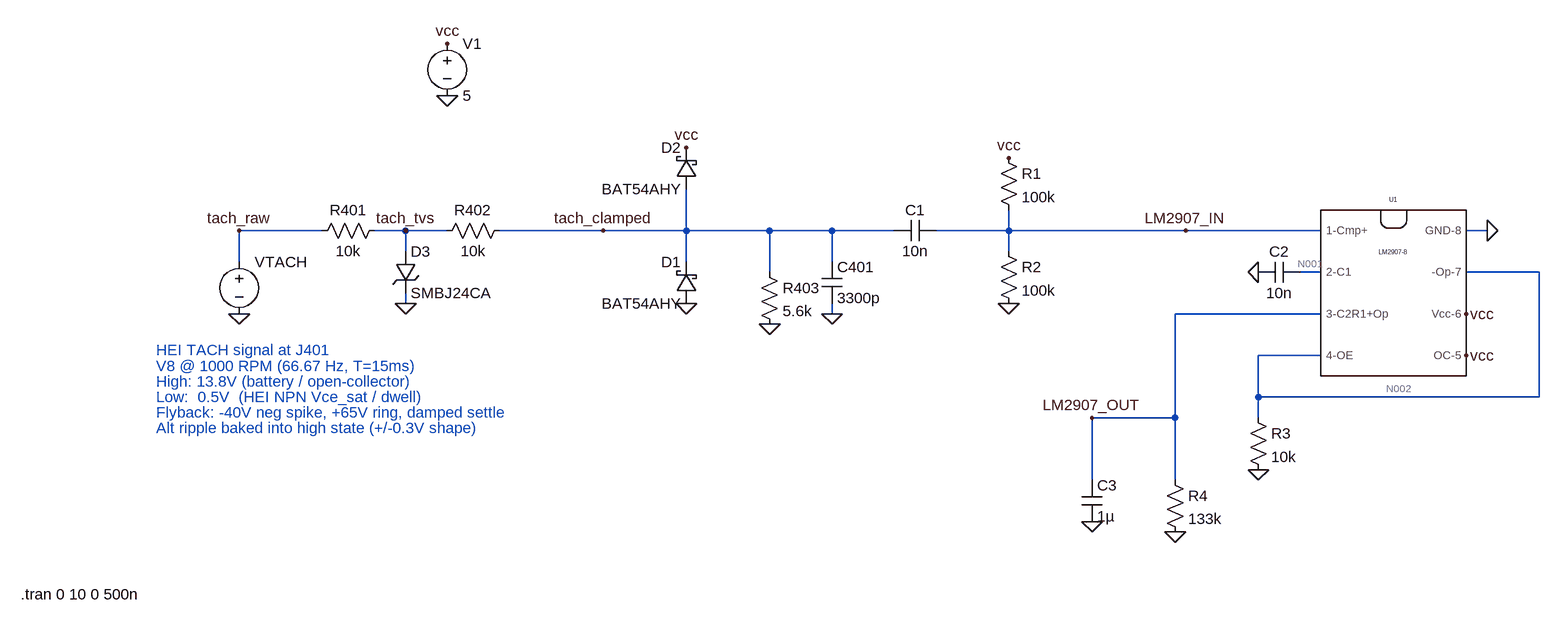
[diagram p0: schematic input_signal_draft.asc]
input_signal_draft.asc, the LTspice schematic file:
Version 4
SHEET 1 14944 1600
WIRE 512 800 384 800
WIRE 640 800 592 800
WIRE 704 800 640 800
WIRE 944 800 784 800
WIRE 1072 800 1072 736
WIRE 1072 800 944 800
WIRE 1200 800 1072 800
WIRE 1296 800 1200 800
WIRE 1392 800 1296 800
WIRE 1568 800 1568 768
WIRE 1568 800 1456 800
WIRE 1840 800 1568 800
WIRE 2048 800 1840 800
WIRE 2304 800 2272 800
WIRE 640 832 640 800
WIRE 1568 832 1568 800
WIRE 384 848 384 800
WIRE 1072 848 1072 800
WIRE 1296 848 1296 800
WIRE 1200 864 1200 800
WIRE 2048 864 2016 864
WIRE 2384 864 2272 864
WIRE 640 912 640 896
WIRE 1296 928 1296 912
WIRE 2048 928 1824 928
WIRE 2048 992 1952 992
WIRE 1952 1056 1952 992
WIRE 2384 1056 2384 864
WIRE 2384 1056 1952 1056
WIRE 1824 1088 1824 928
WIRE 1824 1088 1696 1088
WIRE 1952 1088 1952 1056
WIRE 1696 1184 1696 1088
WIRE 1824 1184 1824 1088
FLAG 384 928 0
FLAG 384 800 tach_raw
FLAG 944 800 tach_clamped
FLAG 1296 928 0
FLAG 1200 944 0
FLAG 1072 912 0
FLAG 704 592 0
FLAG 704 512 vcc
FLAG 1072 672 vcc
FLAG 1568 912 0
FLAG 1568 688 vcc
FLAG 1840 800 LM2907_IN
FLAG 640 912 0
FLAG 640 800 tach_tvs
FLAG 2304 800 0
FLAG 2272 928 vcc
FLAG 2272 992 vcc
FLAG 1952 1168 0
FLAG 1952 864 0
FLAG 1824 1264 0
FLAG 1696 1248 0
FLAG 1696 1088 LM2907_OUT
SYMBOL voltage 384 832 R0
WINDOW 3 -284 449 Invisible 2
WINDOW 123 0 0 Left 0
WINDOW 39 0 0 Left 0
SYMATTR InstName VTACH
SYMATTR Value PWL file=HEI_TACH_V8_1000to6000RPM_10s.txt
SYMBOL res 608 784 R90
WINDOW 0 0 56 VBottom 2
WINDOW 3 32 56 VTop 2
SYMATTR InstName R401
SYMATTR Value 10k
SYMBOL res 800 784 R90
WINDOW 0 0 56 VBottom 2
WINDOW 3 32 56 VTop 2
SYMATTR InstName R402
SYMATTR Value 10k
SYMBOL res 1184 848 R0
SYMATTR InstName R403
SYMATTR Value 5.6k
SYMBOL cap 1280 848 R0
SYMATTR InstName C401
SYMATTR Value 3300p
SYMBOL schottky 1088 736 R180
WINDOW 0 24 64 Left 2
WINDOW 3 24 0 Left 2
SYMATTR InstName D2
SYMATTR Value BAT54AHY
SYMATTR Description Diode
SYMATTR Type diode
SYMBOL schottky 1088 912 R180
WINDOW 0 24 64 Left 2
WINDOW 3 24 0 Left 2
SYMATTR InstName D1
SYMATTR Value BAT54AHY
SYMATTR Description Diode
SYMATTR Type diode
SYMBOL voltage 704 496 R0
SYMATTR InstName V1
SYMATTR Value 5
SYMBOL cap 1456 784 R90
WINDOW 0 0 32 VBottom 2
WINDOW 3 32 32 VTop 2
SYMATTR InstName C1
SYMATTR Value 10n
SYMBOL res 1552 672 R0
SYMATTR InstName R1
SYMATTR Value 100k
SYMBOL res 1552 816 R0
SYMATTR InstName R2
SYMATTR Value 100k
SYMBOL TVSdiode 624 832 R0
SYMATTR InstName D3
SYMATTR Value SMBJ24CA
SYMBOL LM2907-8 2160 896 R0
SYMATTR InstName U1
SYMBOL res 1936 1072 R0
SYMATTR InstName R3
SYMATTR Value 10k
SYMBOL cap 2016 848 R90
WINDOW 0 0 32 VBottom 2
WINDOW 3 32 32 VTop 2
SYMATTR InstName C2
SYMATTR Value 10n
SYMBOL res 1808 1168 R0
SYMATTR InstName R4
SYMATTR Value 133k
SYMBOL cap 1680 1184 R0
SYMATTR InstName C3
SYMATTR Value 1µ
TEXT 256 984 Left 2 ;HEI TACH signal at J401
TEXT 256 1008 Left 2 ;V8 @ 1000 RPM (66.67 Hz, T=15ms)
TEXT 256 1032 Left 2 ;High: 13.8V (battery / open-collector)
TEXT 256 1056 Left 2 ;Low:  0.5V  (HEI NPN Vce_sat / dwell)
TEXT 256 1080 Left 2 ;Flyback: -40V neg spike, +65V ring, damped settle
TEXT 256 1104 Left 2 ;Alt ripple baked into high state (+/-0.3V shape)
TEXT 48 1360 Left 2 !.tran 0 10 0 500n

The netlist it stands for:
* input_signal_draft.asc
VTACH tach_raw 0 PWL file=HEI_TACH_V8_1000to6000RPM_10s.txt
R401 tach_tvs tach_raw 10k
R402 tach_clamped tach_tvs 10k
R403 tach_clamped 0 5.6k
C401 tach_clamped 0 3300p
D2 tach_clamped vcc BAT54AHY
D1 0 tach_clamped BAT54AHY
V1 vcc 0 5
C1 LM2907_IN tach_clamped 10n
R1 vcc LM2907_IN 100k
R2 LM2907_IN 0 100k
D3 tach_tvs 0 SMBJ24CA
XU1 LM2907_IN N001 LM2907_OUT N002 vcc vcc N002 0 LM2907-8  ; pins 1-Cmp+ 2-C1 3-C2R1+Op 4-OE OC-5 Vcc-6 -Op-7 GND-8
R3 N002 0 10k
C2 N001 0 10n
R4 LM2907_OUT 0 133k
C3 LM2907_OUT 0 1µ
.model D D
.lib standard.dio
* HEI TACH signal at J401
* V8 @ 1000 RPM (66.67 Hz, T=15ms)
* High: 13.8V (battery / open-collector)
* Low:  0.5V  (HEI NPN Vce_sat / dwell)
* Flyback: -40V neg spike, +65V ring, damped settle
* Alt ripple baked into high state (+/-0.3V shape)
.tran 0 10 0 500n
.lib LM29x7.SUB
.backanno
.end

* Results of the author's LTspice run, read from the files saved beside the schematic
* Operating Point, zero values left out:
*   V(tach_raw) = 13.8 V
*   V(tach_tvs) = 8.408 V
*   V(tach_clamped) = 3.018 V
*   V(vcc) = 5 V
*   V(lm2907_in) = 888.5 mV
*   V(n001) = 165.7 nV
*   V(lm2907_out) = 42.4 µV
*   V(n002) = 37.89 µV
*   I(D3) = 168.2 nA
*   I(D1) = -157.2 nA
*   I(D2) = -139.9 nA
*   I(R4) = 318.8 pA
*   I(R3) = 3.789 nA
*   I(R2) = 8.885 µA
*   I(R1) = 41.11 µA
*   I(R403) = 539 µA
*   I(R402) = -539 µA
*   I(R401) = -539.2 µA
*   I(V1) = -439.3 µA
*   I(Vtach) = -539.2 µA
*   Ix(u1:I1) = 32.23 µA
*   Ix(u1:I2) = -2.986 pA
*   Ix(u1:I3) = -318.8 pA
*   Ix(u1:I4) = -3.789 nA
*   Ix(u1:I5) = 3.755 nA
*   Ix(u1:I6) = 398 µA
*   Ix(u1:I8) = -430.2 µA